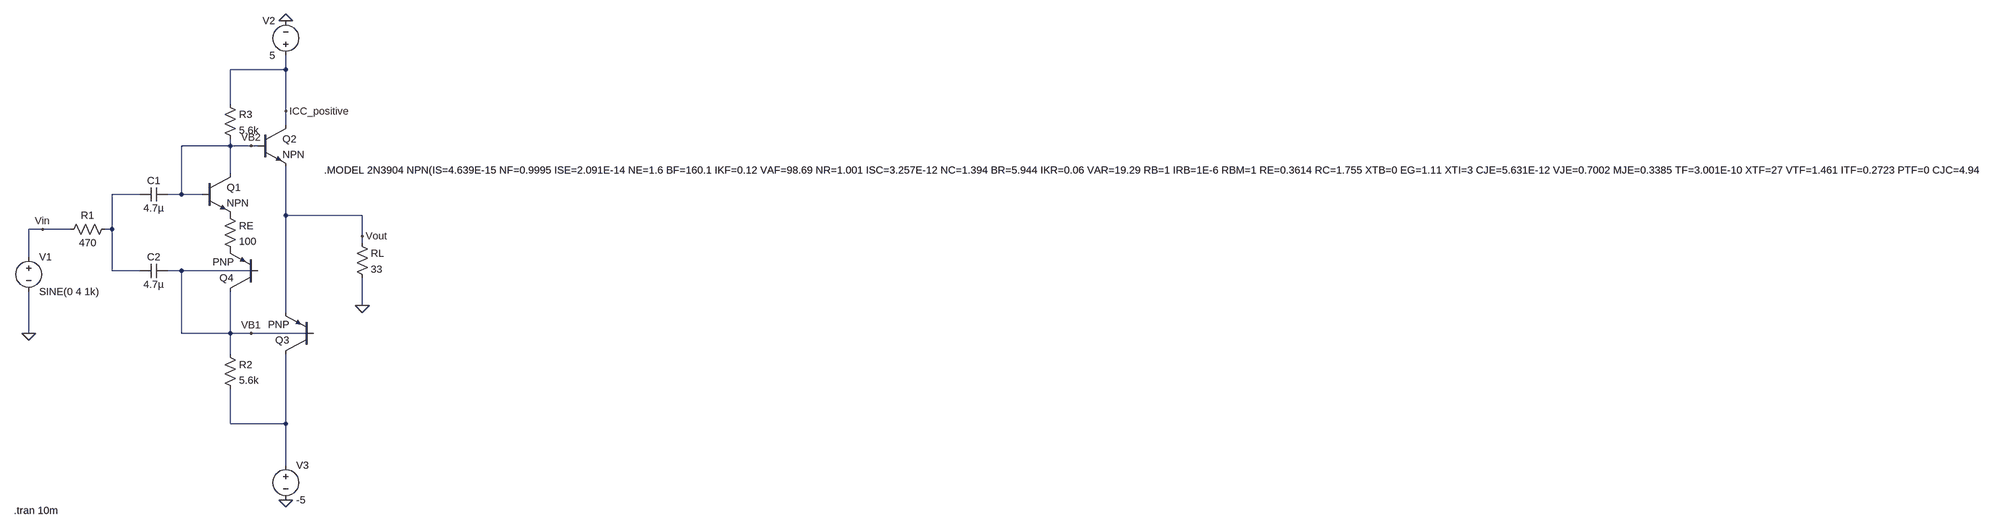
[diagram p0: schematic Lab7_2.asc]
Lab7_2.asc, the LTspice schematic file:
Version 4
SHEET 1 5984 680
WIRE 688 -352 688 -384
WIRE 688 -352 560 -352
WIRE 560 -272 560 -352
WIRE 688 -256 688 -352
WIRE 688 -224 688 -256
WIRE 560 -176 560 -192
WIRE 560 -176 448 -176
WIRE 608 -176 560 -176
WIRE 624 -176 608 -176
WIRE 560 -112 560 -176
WIRE 352 -64 288 -64
WIRE 448 -64 448 -176
WIRE 448 -64 416 -64
WIRE 496 -64 448 -64
WIRE 688 -16 688 -128
WIRE 864 -16 688 -16
WIRE 128 16 96 16
WIRE 192 16 128 16
WIRE 288 16 288 -64
WIRE 288 16 272 16
WIRE 864 32 864 -16
WIRE 864 48 864 32
WIRE 96 80 96 16
WIRE 288 112 288 16
WIRE 352 112 288 112
WIRE 448 112 416 112
WIRE 624 112 448 112
WIRE 864 192 864 128
WIRE 688 208 688 -16
WIRE 96 256 96 160
WIRE 448 256 448 112
WIRE 560 256 560 160
WIRE 560 256 448 256
WIRE 608 256 560 256
WIRE 752 256 608 256
WIRE 560 304 560 256
WIRE 560 464 560 384
WIRE 688 464 688 304
WIRE 688 464 560 464
WIRE 688 560 688 464
FLAG 96 256 0
FLAG 688 -464 0
FLAG 864 192 0
FLAG 688 640 0
FLAG 608 -176 VB2
FLAG 608 256 VB1
FLAG 688 -256 ICC_positive
FLAG 864 32 Vout
FLAG 128 16 Vin
SYMBOL voltage 96 64 R0
WINDOW 123 0 0 Left 0
WINDOW 39 0 0 Left 0
SYMATTR InstName V1
SYMATTR Value SINE(0 4 1k)
SYMBOL res 288 0 R90
WINDOW 0 0 56 VBottom 2
WINDOW 3 32 56 VTop 2
SYMATTR InstName R1
SYMATTR Value 470
SYMBOL cap 416 -80 R90
WINDOW 0 0 32 VBottom 2
WINDOW 3 32 32 VTop 2
SYMATTR InstName C1
SYMATTR Value 4.7µ
SYMBOL cap 416 96 R90
WINDOW 0 0 32 VBottom 2
WINDOW 3 32 32 VTop 2
SYMATTR InstName C2
SYMATTR Value 4.7µ
SYMBOL npn 496 -112 R0
SYMATTR InstName Q1
SYMBOL res 544 -32 R0
SYMATTR InstName RE
SYMATTR Value 100
SYMBOL npn 624 -224 R0
SYMATTR InstName Q2
SYMBOL res 544 -288 R0
SYMATTR InstName R3
SYMATTR Value 5.6k
SYMBOL voltage 688 -368 R180
WINDOW 0 24 96 Left 2
WINDOW 3 24 16 Left 2
WINDOW 123 0 0 Left 0
WINDOW 39 0 0 Left 0
SYMATTR InstName V2
SYMATTR Value 5
SYMBOL res 848 32 R0
SYMATTR InstName RL
SYMATTR Value 33
SYMBOL pnp 624 160 R180
SYMATTR InstName Q4
SYMBOL pnp 752 304 R180
SYMATTR InstName Q3
SYMBOL res 544 288 R0
SYMATTR InstName R2
SYMATTR Value 5.6k
SYMBOL voltage 688 544 R0
WINDOW 123 0 0 Left 0
WINDOW 39 0 0 Left 0
SYMATTR InstName V3
SYMATTR Value -5
TEXT 776 -120 Left 2 !.MODEL 2N3904 NPN(IS=4.639E-15 NF=0.9995 ISE=2.091E-14 NE=1.6 BF=160.1 IKF=0.12 VAF=98.69 NR=1.001 ISC=3.257E-12 NC=1.394 BR=5.944 IKR=0.06 VAR=19.29 RB=1 IRB=1E-6 RBM=1 RE=0.3614 RC=1.755 XTB=0 EG=1.11 XTI=3 CJE=5.631E-12 VJE=0.7002 MJE=0.3385 TF=3.001E-10 XTF=27 VTF=1.461 ITF=0.2723 PTF=0 CJC=4.949E-12 VJC=0.5969 MJC=0.1928 XCJC=0.864 TR=9.4E-8 CJS=0 VJS=0.75 MJS=0.333 FC=0.5582)
TEXT 62 664 Left 2 !.tran 10m

The netlist it stands for:
* Lab7_2.asc
V1 Vin 0 SINE(0 4 1k)
R1 N001 Vin 470
C1 VB2 N001 4.7µ
C2 VB1 N001 4.7µ
Q1 VB2 VB2 P001 0 NPN
RE P001 P002 100
Q2 ICC_positive VB2 Vout 0 NPN
R3 ICC_positive VB2 5.6k
V2 ICC_positive 0 5
RL Vout 0 33
Q4 VB1 VB1 P002 0 PNP
Q3 N002 VB1 Vout 0 PNP
R2 VB1 N002 5.6k
V3 N002 0 -5
.model NPN NPN
.model PNP PNP
.lib standard.bjt
.MODEL 2N3904 NPN(IS=4.639E-15 NF=0.9995 ISE=2.091E-14 NE=1.6 BF=160.1 IKF=0.12 VAF=98.69 NR=1.001 ISC=3.257E-12 NC=1.394 BR=5.944 IKR=0.06 VAR=19.29 RB=1 IRB=1E-6 RBM=1 RE=0.3614 RC=1.755 XTB=0 EG=1.11 XTI=3 CJE=5.631E-12 VJE=0.7002 MJE=0.3385 TF=3.001E-10 XTF=27 VTF=1.461 ITF=0.2723 PTF=0 CJC=4.949E-12 VJC=0.5969 MJC=0.1928 XCJC=0.864 TR=9.4E-8 CJS=0 VJS=0.75 MJS=0.333 FC=0.5582)
.tran 10m
.backanno
.end